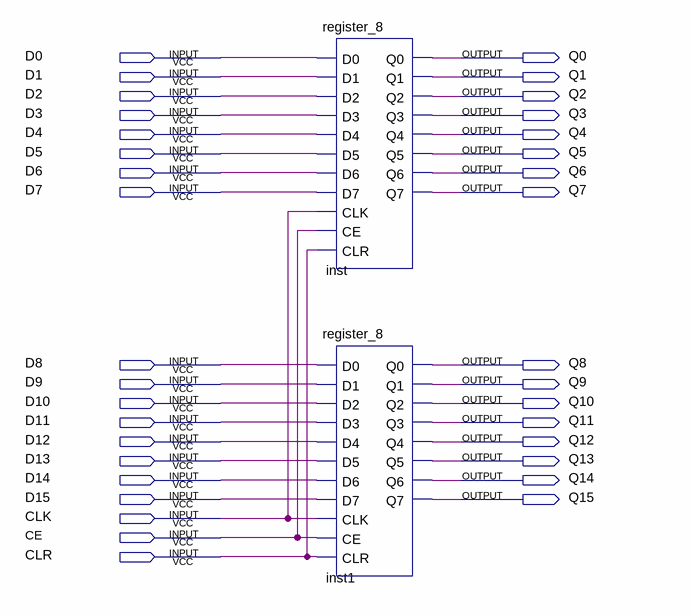
[diagram p0: schematic sheet]
// Quartus schematic register_16.bdf as structural Verilog: 2 symbols, 35 pins
module register_16 (
  input  D0,
  input  D1,
  input  D2,
  input  D3,
  input  D4,
  input  D5,
  input  D6,
  input  D7,
  input  D8,
  input  D9,
  input  D10,
  input  D11,
  input  D12,
  input  D13,
  input  D14,
  input  D15,
  input  CLK,
  input  CE,
  input  CLR,
  output Q0,
  output Q1,
  output Q2,
  output Q3,
  output Q4,
  output Q5,
  output Q6,
  output Q7,
  output Q8,
  output Q9,
  output Q10,
  output Q11,
  output Q12,
  output Q13,
  output Q14,
  output Q15
);

  register_8 inst (
    .D0(D0), .D1(D1), .D2(D2), .D3(D3), .D4(D4), .D5(D5), .D6(D6), .D7(D7), .CLK(CLK), .CE(CE), .CLR(CLR),
    .Q0(Q0), .Q1(Q1), .Q2(Q2), .Q3(Q3), .Q4(Q4), .Q5(Q5), .Q6(Q6), .Q7(Q7));
  register_8 inst1 (
    .D0(D8), .D1(D9), .D2(D10), .D3(D11), .D4(D12), .D5(D13), .D6(D14), .D7(D15), .CLK(CLK), .CE(CE),
    .CLR(CLR), .Q0(Q8), .Q1(Q9), .Q2(Q10), .Q3(Q11), .Q4(Q12), .Q5(Q13), .Q6(Q14), .Q7(Q15));
endmodule
